# EAGLE design Face_You_Like (EAGLE 9.6.0)
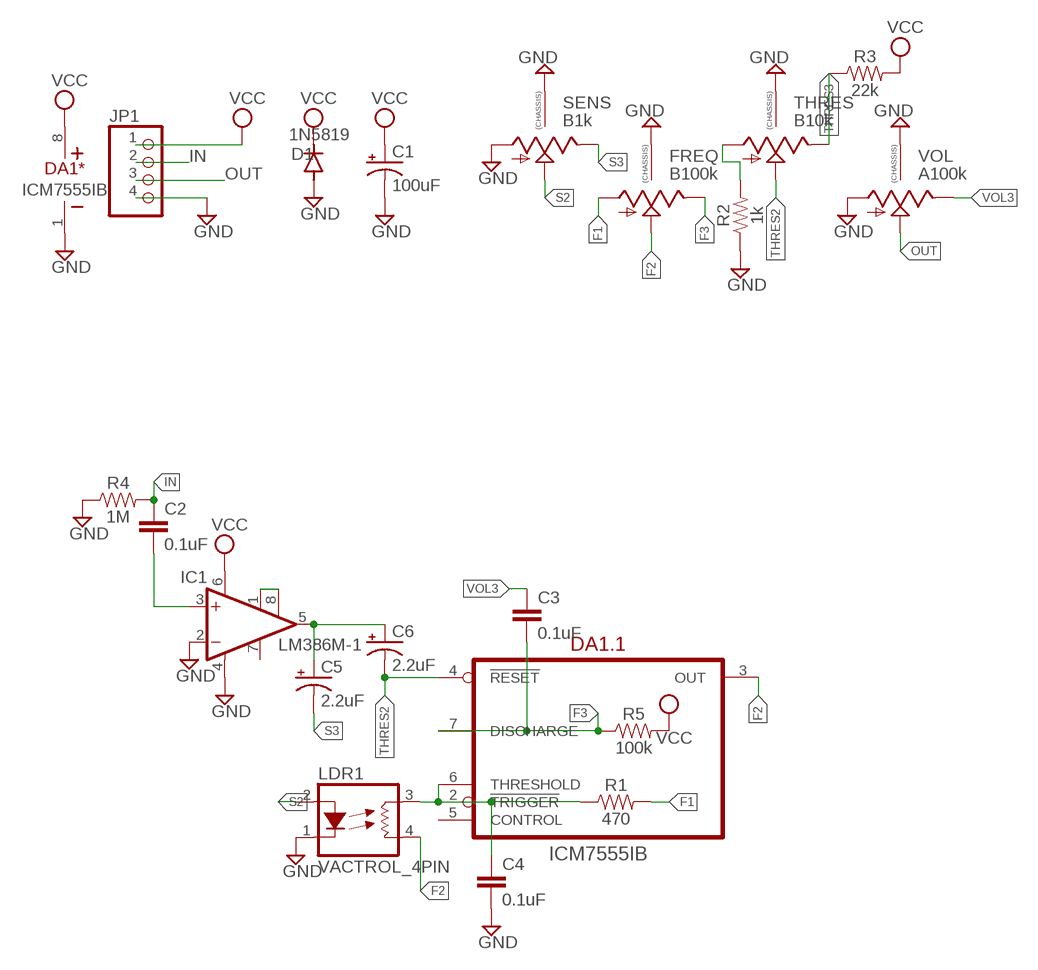
[diagram p0: schematic, sheet 1]

## Parts
C1  100uF  CAP_SMD+THRUPAN_B  [PAN_B_SMD+THRU]
C2  0.1uF  0.1UF-0603-25V-(+80/-20%)  [0603]
C3  0.1uF  0.1UF-0603-25V-(+80/-20%)  [0603]
C4  0.1uF  0.1UF-0603-25V-(+80/-20%)  [0603]
C5  2.2uF  CAP_SMD+THRUPAN_B  [PAN_B_SMD+THRU]
C6  2.2uF  CAP_SMD+THRUPAN_B  [PAN_B_SMD+THRU]
D1  1N5819  DIODE-SOD123  [SOD123]
DA1  ICM7555IB  [SO-8]
FREQ  B100k  9MM_SNAP-IN_POT_CHASSIS  [9MM_SNAP-IN_POT]
IC1  LM386M-1  [SO08]
JP1  PINHD-1X4  [1X04]
LDR1  VACTROL_4PIN  [VACTROL_4PIN_VTL5C]
R1  470  470OHM-0603-1/10W-1%  [0603]
R2  1k  1KOHM-0603-1/10W-1%  [0603]
R3  22k  22KOHM-0603-1/10W-1%  [0603]
R4  1M  1MOHM-0603-1/4W-5%  [0603]
R5  100k  100KOHM-0603-1/10W-1%  [0603]
SENS  B1k  9MM_SNAP-IN_POT_CHASSIS  [9MM_SNAP-IN_POT]
THRES  B10k  9MM_SNAP-IN_POT_CHASSIS  [9MM_SNAP-IN_POT]
VOL  A100k  9MM_SNAP-IN_POT_CHASSIS  [9MM_SNAP-IN_POT]

## Nets
F1: FREQ.1(A) R1.2
F2: DA1.3(.1:OUT) FREQ.2(S) LDR1.4(RES2)
F3: C3.2 DA1.7(.1:DISCHARGE) FREQ.3(E) R5.1
GND: C1.- C1.--(-) C4.2 D1.A DA1.1(*:V-) FREQ.CHASSIS1 FREQ.CHASSIS2 IC1.2(-IN) IC1.4(GND) JP1.4 LDR1.1(LED-) R2.1 R4.1 SENS.1(A) SENS.CHASSIS1 SENS.CHASSIS2 THRES.CHASSIS1 THRES.CHASSIS2 VOL.1(A) VOL.CHASSIS1 VOL.CHASSIS2
IN: C2.1 JP1.2 R4.2
N$1: IC1.1(GAIN) IC1.8(GAIN)
N$2: C2.2 IC1.3(+IN)
N$3: R2.2 THRES.1(A)
N$4: C5.+ C5.++(+) C6.+ C6.++(+) IC1.5(OUT)
N$5: C4.1 DA1.2(.1:!TRIGGER) DA1.6(.1:THRESHOLD) LDR1.3(RES1) R1.1
OUT: JP1.3 VOL.2(S)
S2: LDR1.2(LED+) SENS.2(S)
S3: C5.- C5.--(-) SENS.3(E)
THRES2: C6.- C6.--(-) DA1.4(.1:!RESET) THRES.2(S)
THRES3: R3.1 THRES.3(E)
VCC: C1.+ C1.++(+) D1.C DA1.8(*:V+) IC1.6(VS) JP1.1 R3.2 R5.2
VOL3: C3.1 VOL.3(E)
Unconnected: DA1.5(.1:CONTROL) IC1.7(BYPASS)

## Library data of the parts
C1 C5 C6 = MusicThingModular:CAP_SMD+THRU
C2-C4 = SparkFun-Capacitors:0.1UF: 0.1µF ceramic capacitors A capacitor is a passive two-terminal electrical component used to store electrical energy temporarily in an electric field.; PROD_ID: CAP-00810
D1 = diode:DIODE-: DIODE
DA1 = ic-logic:ICM7555?
FREQ SENS THRES VOL = MusicThingModular:9MM_SNAP-IN_POT_CHASSIS: 9mm vertical snap-in pot, Alpha / Panasonic style, with a connection to the metal chassis for grounding
IC1 = linear:LM386?-*: Low Voltage Audio Power Amplifier Source: http://cache.national.com/ds/LM/LM386.pdf
JP1 = Connector:PINHD-1X4: PIN HEADER; CATEGORY: CONNECTOR; SUB-CATEGORY: PIN-HEADER
LDR1 = MusicThingModular:VACTROL_4PIN: 4 Pin Vactrol Resistive Photocoupler
R1 = SparkFun-Resistors:470OHM: 470Ω resistor A resistor is a passive two-terminal electrical component that implements electrical resistance as a circuit element. Resistors act to reduce current flow, and, at the same time, act to lower voltage levels within circuits. - Wikipedia; PROD_ID: RES-07869
R2 = SparkFun-Resistors:1KOHM: 1kΩ resistor A resistor is a passive two-terminal electrical component that implements electrical resistance as a circuit element. Resistors act to reduce current flow, and, at the same time, act to lower voltage levels within circuits. - Wikipedia; PROD_ID: RES-07856
R3 = SparkFun-Resistors:22KOHM: 22kΩ resistor A resistor is a passive two-terminal electrical component that implements electrical resistance as a circuit element. Resistors act to reduce current flow, and, at the same time, act to lower voltage levels within circuits. - Wikipedia; PROD_ID: RES-07853
R4 = SparkFun-Resistors:1MOHM: 1MΩ resistor A resistor is a passive two-terminal electrical component that implements electrical resistance as a circuit element. Resistors act to reduce current flow, and, at the same time, act to lower voltage levels within circuits. - Wikipedia; PROD_ID: RES-07868
R5 = SparkFun-Resistors:100KOHM: 100kΩ resistor A resistor is a passive two-terminal electrical component that implements electrical resistance as a circuit element. Resistors act to reduce current flow, and, at the same time, act to lower voltage levels within circuits. - Wikipedia; PROD_ID: RES-07828

## Board
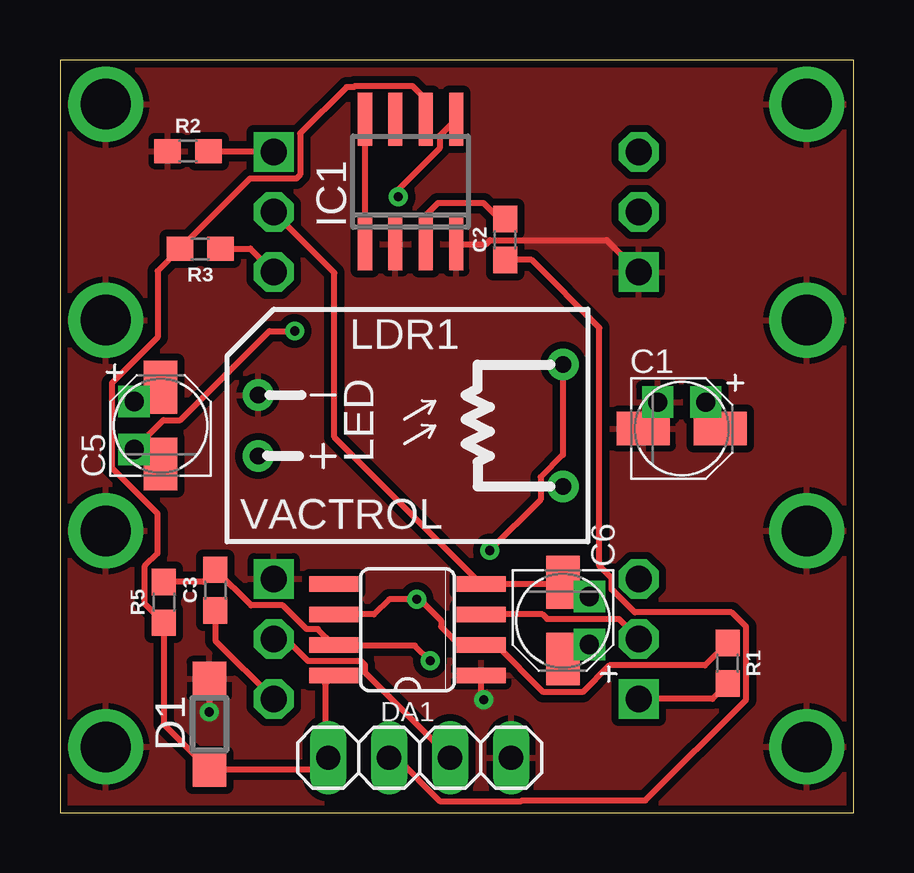
[diagram p1: board, top side]
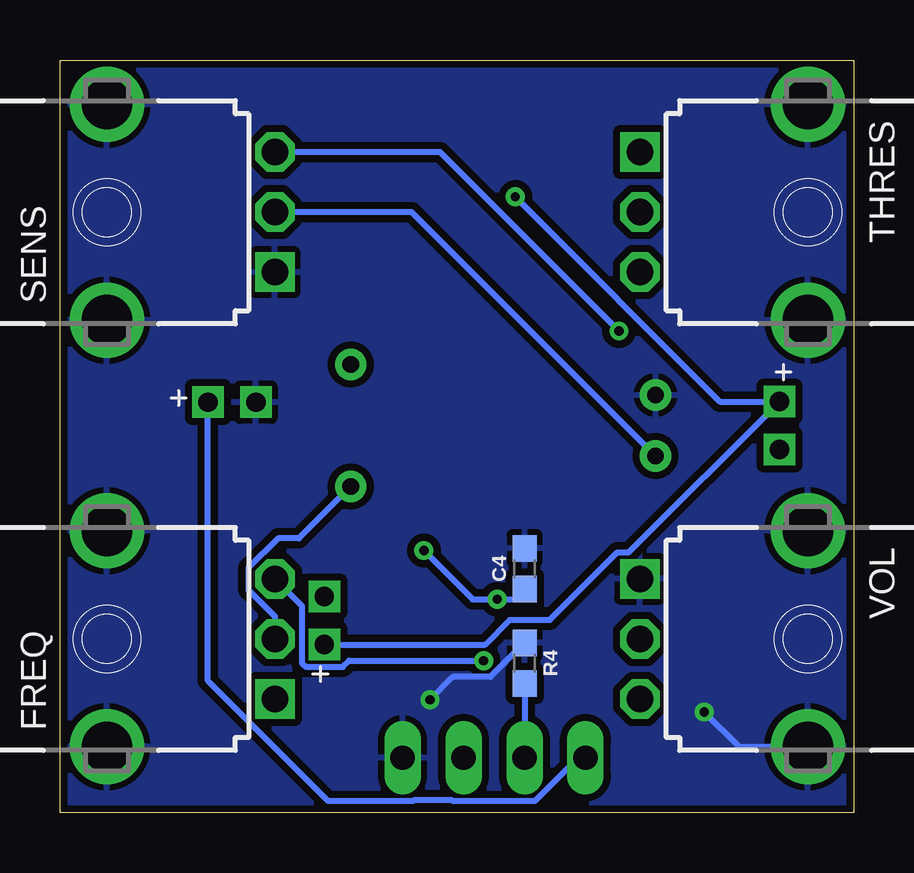
[diagram p2: board, bottom side, seen from below]

Size 33.07 x 31.36 mm. Coordinates in mm from the lower left corner, seen from the top.
Outline: 0,0 33.07,0 33.07,31.36 0,31.36 0,0
Copper layers (1*16): Top 0.035mm / dielectric 1.5mm / Bottom 0.035mm
Design rules "default *": minimum track width 6mil, minimum drill 0.35mm, track to track 6mil, track to pad 6mil, pad to pad 6mil, via to via 6mil, smd to smd 6mil, copper to edge 8mil, drill to drill 6mil, minimum pad ring 10mil, minimum via ring 8mil, stop-mask expansion 4mil, vias tented up to drill 0mil, thermal gap 10mil

### Footprints (pad centres in the part's own frame; a part is rotated, then mirrored left to right if it is on the bottom)
PAN_B_SMD+THRU = smd 2.2 x 1.4: + 1.6,0; - -1.6,0 | drill 0.8 pad 0.9 square: ++ 1,1.1; -- -1,1.1
0603 = smd 1.1 x 1: 1 -0.85,0; 2 0.85,0
SOD123 = smd 1.4 x 1.4: A 1.9,0; C -1.9,0
SO-8 = smd 0.66 x 2.032: 1 -1.905,-3.073; 2 -0.635,-3.073; 3 0.635,-3.073; 4 1.905,-3.073; 5 1.905,3.073; 6 0.635,3.073; 7 -0.635,3.073; 8 -1.905,3.073
9MM_SNAP-IN_POT = drill 1.1 square: 1 -2.5,-7 | drill 1.1 octagon: 2 0,-7; 3 2.5,-7 | drill 2.1 pad 2.794: CHASSIS1 -4.5,0; CHASSIS2 4.5,0
SO08 = smd 0.6 x 2.2: 1 -1.905,-2.6; 2 -0.635,-2.6; 3 0.635,-2.6; 4 1.905,-2.6; 5 1.905,2.6; 6 0.635,2.6; 7 -0.635,2.6; 8 -1.905,2.6
1X04 = drill 1.016 long: 1 -3.81,0; 2 -1.27,0; 3 1.27,0; 4 3.81,0
VACTROL_4PIN_VTL5C = drill 0.7 pad 1.3: 1 -6.35,1.27; 2 -6.35,-1.27; 3 6.35,2.54; 4 6.35,-2.54

### Placement (x,y rotation side)
C1  25.91,16 0 top
C2  18.54,23.88 90 top
C3  6.48,9.27 90 top
C4  13.72,10.16 90 bottom
C5  4.19,16.13 90 top
C6  20.95,8 270 top
D1  6.22,3.68 90 top
DA1  14.48,7.62 90 top
FREQ  31.11,7.24 90 bottom
IC1  14.61,26.29 0 top
JP1  14.99,2.29 0 top
LDR1  14.61,16.13 0 top
R1  27.81,6.22 270 top
R2  5.33,27.56 0 top
R3  5.84,23.5 180 top
R4  13.72,6.22 270 bottom
R5  4.32,8.76 270 top
SENS  31.11,25.02 90 bottom
THRES  1.91,25.02 270 bottom
VOL  1.91,7.24 270 bottom

### Tracks (layer width: path | path; a pad name or v marks a point on that pad's centre or on a via)
F1
  Top 0.254: R1.2 27.18,4.74 FREQ.1
F2
  Top 0.254: DA1.3 20.11,8.26 20.29,8.07 23.29,8.07 FREQ.2
  Bottom 0.254: LDR1.4 23.11,11.43 23.99,11.43 25.22,10.2 25.22,9.28 24.11,8.18 FREQ.2
F3  (via drill 0.38)
  Top 0.254: R5.1 5.97,9.61 C3.2 7.96,8.63 9.28,8.63 10.27,7.64 10.74,7.64 DA1.7 11.43,6.96 14.79,6.96 v15.42,6.33
  Bottom 0.254: FREQ.3 22.99,8.61 22.99,6.23 22.82,6.07 21.29,6.07 21.02,6.33 v15.42,6.33
GND  (via drill 0.38)
  Top 0.254: v17.65,4.7 17.55,4.8 DA1.1 | D1.A v6.22,4.19 | IC1.4 17.76,23.69 17.93,23.86 22.78,23.86 SENS.1
  Bottom 0.254: R4.1 15.14,5.66 16.7,5.66 v17.65,4.7 | v6.22,4.19 4.77,2.74 VOL.CHASSIS2
  pour Bottom (isolate 0.305): -0.25,-0.76 32.89,-0.76 33.4,-0.25 33.4,32 -0.25,32 -0.76,31.5 -0.76,-0.38 -0.38,-0.76
  pour Top (isolate 0.305): -0.38,-0.64 33.02,-0.64 33.4,-0.25 33.4,32 0,32 -0.76,31.24 -0.76,-0.25
IN
  Top 0.254: JP1.2 14.02,2.29 15.82,0.48 19.23,0.48 19.25,0.51 24.39,0.51 28.59,4.71 28.59,7.74 27.99,8.34 23.95,8.34 22.99,9.3 22.99,9.77 22.48,10.28 22.48,20.19 19.65,23.03 C2.1
  Bottom 0.254: R4.2 JP1.2
N$1
  Top 0.254: IC1.8 IC1.1
N$2
  Top 0.254: C2.2 18.33,24.73 17.65,25.4 15.75,25.4 15.24,24.89 IC1.3
N$3
  Top 0.254: R2.2 8.87,27.56 THRES.1
N$4  (via drill 0.38)
  Top 0.254: C5.++ 3.69,17.73 C5.+ | C6.++ 21.45,6.4 C6.+ | IC1.5 15.82,28.2 15.82,27.67 14.1,25.95 v14.1,25.65
  Bottom 0.254: C6.++ 15.36,7 14.33,8.03 12.66,8.03 9.85,10.84 9.38,10.84 C5.++ 5.57,17.13 v14.1,25.65
N$5  (via drill 0.38)
  Top 0.254: DA1.6 13.08,8.26 13.72,8.89 v14.86,8.89 14.99,8.89 15.88,8 15.88,7.75 16.64,6.99 DA1.2 18.18,6.99 20.14,5.02 21.78,5.02 22.89,6.13 26.88,6.13 R1.1 | LDR1.3 20.95,14.9 20.03,13.97 20.03,13.04 v17.91,10.92
  Bottom 0.254: C4.1 14.14,8.89 v14.86,8.89 15.88,8.89 v17.91,10.92
OUT
  Top 0.254: JP1.3 12.7,5.84 12.7,6.16 12.54,6.33 10.32,6.33 9.41,7.24 VOL.2
S2
  Bottom 0.254: LDR1.2 18.41,25.02 SENS.2
S3  (via drill 0.38)
  Top 0.254: C5.- 3.59,15.13 C5.-- 4.31,16.35 5.01,16.35 8.72,20.07 v9.78,20.07
  Bottom 0.254: v9.78,20.07 17.23,27.52 SENS.3
THRES2
  Top 0.254: C6.-- 21.55,9 C6.- 20.88,9.53 DA1.4 11.43,15.65 11.43,22.49 THRES.2
THRES3
  Top 0.254: R3.1 7.93,23.5 THRES.3
VCC
  Top 0.254: JP1.1 11.05,2.16 | 11.05,2.16 10.67,1.78 D1.C 4.32,3.69 R5.2 3.54,8.69 3.54,10.28 4.06,10.8 4.06,12.45 2.16,14.36 2.16,17.9 4.06,19.8 4.06,22.57 R3.2 7.91,26.41 9.85,26.41 10.01,26.58 10.01,28.3 11.94,30.23 12.24,30.23 12.28,30.27 14.69,30.27 15.11,29.84 15.11,29.02 IC1.6 | DA1.8 11.05,5.36 11.05,2.16 | C1.++ 27.51,16.5 C1.+
  Bottom 0.254: JP1.1 11.48,2.29 13.29,0.48 16.69,0.48 16.71,0.51 18.34,0.51 18.36,0.48 21.9,0.48 26.91,5.49 C1.++
VOL3
  Top 0.254: C3.1 6.48,7.17 VOL.3